# Altium schematic sheet Carrier_MCU.SchDoc: PSoC6
size A; Revision: A; SheetNumber: 8; SheetTotal: 10; ECE315_Project_Name: ECE453 F25 Staff Dev Board
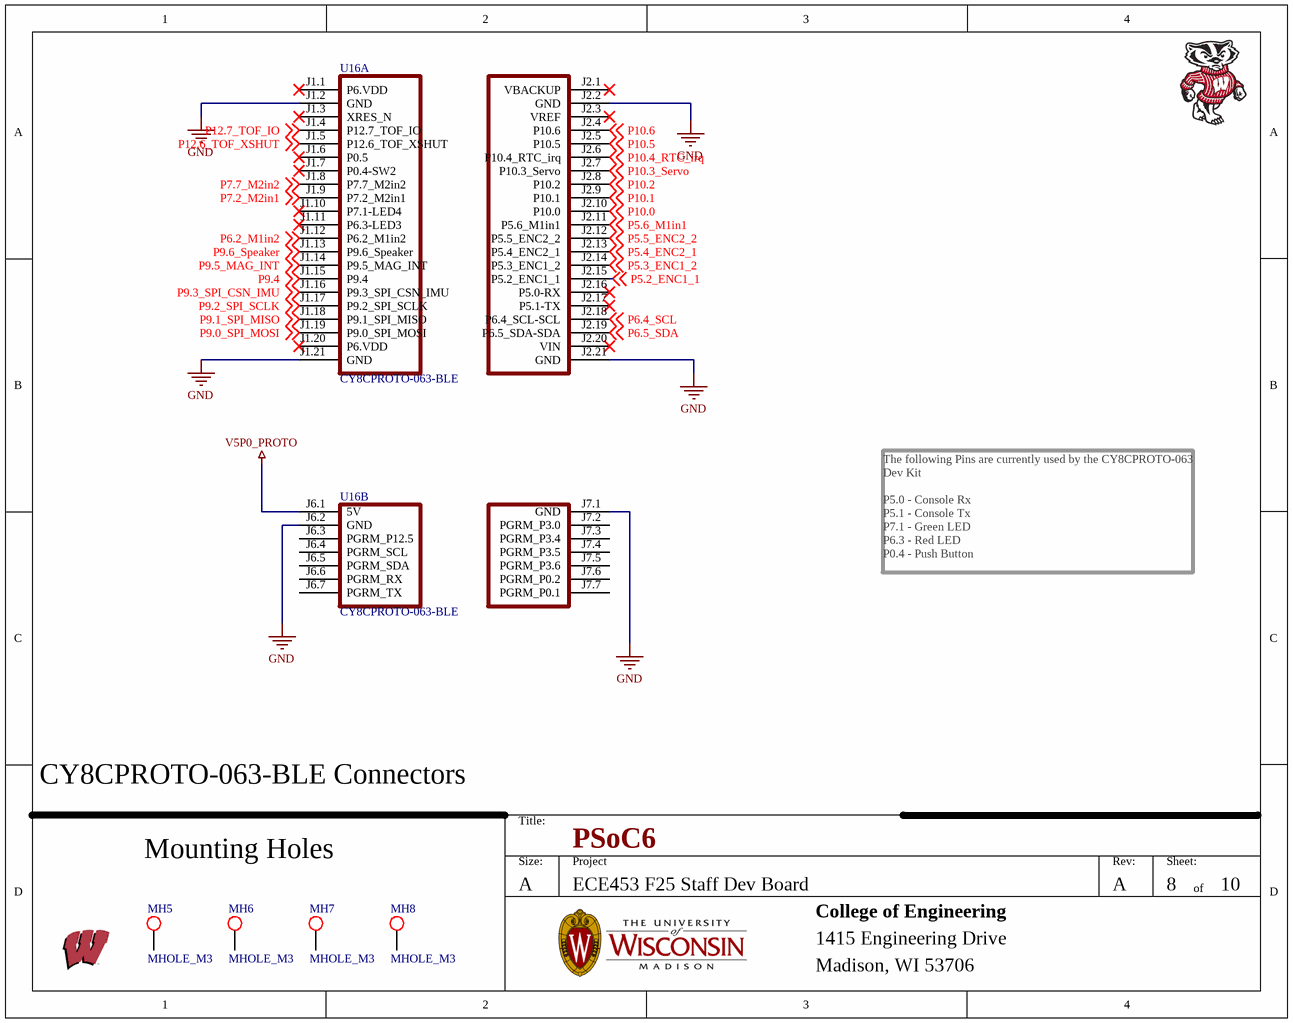
[diagram p0: Carrier_MCU.SchDoc]

## Parts
MH5  MHOLE_M3  [MHOLE_M3]  (no BOM)
MH6  MHOLE_M3  [MHOLE_M3]  (no BOM)
MH7  MHOLE_M3  [MHOLE_M3]  (no BOM)
MH8  MHOLE_M3  [MHOLE_M3]  (no BOM)
U16  CY8CPROTO-063-BLE  [CY8CPROTO-063-BLE]  (parts A,B of 2)  (no BOM)

## Nets
GND: U16.J1.2(GND) U16.J1.21(GND) U16.J2.2(GND) U16.J2.21(GND) U16.J6.2(GND) U16.J7.1(GND)
V5P0_PROTO: U16.J6.1(5V)
P5.2_ENC1_1: U16.J2.15(P5.2_ENC1_1) ; off-sheet P5.2_ENC1_1
P5.3_ENC1_2: U16.J2.14(P5.3_ENC1_2) ; off-sheet P5.3_ENC1_2
P5.4_ENC2_1: U16.J2.13(P5.4_ENC2_1) ; off-sheet P5.4_ENC2_1
P5.5_ENC2_2: U16.J2.12(P5.5_ENC2_2) ; off-sheet P5.5_ENC2_2
P5.6_M1in1: U16.J2.11(P5.6_M1in1) ; off-sheet P5.6_M1in1
P6.2_M1in2: U16.J1.12(P6.2_M1in2) ; off-sheet P6.2_M1in2
P6.4_SCL: U16.J2.18(P6.4_SCL-SCL) ; off-sheet P6.4_SCL
P6.5_SDA: U16.J2.19(P6.5_SDA-SDA) ; off-sheet P6.5_SDA
P7.2_M2in1: U16.J1.9(P7.2_M2in1) ; off-sheet P7.2_M2in1
P7.7_M2in2: U16.J1.8(P7.7_M2in2) ; off-sheet P7.7_M2in2
P9.0_SPI_MOSI: U16.J1.19(P9.0_SPI_MOSI) ; off-sheet P9.0_SPI_MOSI
P9.1_SPI_MISO: U16.J1.18(P9.1_SPI_MISO) ; off-sheet P9.1_SPI_MISO
P9.2_SPI_SCLK: U16.J1.17(P9.2_SPI_SCLK) ; off-sheet P9.2_SPI_SCLK
P9.3_SPI_CSN_IMU: U16.J1.16(P9.3_SPI_CSN_IMU) ; off-sheet P9.3_SPI_CSN_IMU
P9.4: U16.J1.15(P9.4) ; off-sheet P9.4
P9.5_MAG_INT: U16.J1.14(P9.5_MAG_INT) ; off-sheet P9.5_MAG_INT
P9.6_Speaker: U16.J1.13(P9.6_Speaker) ; off-sheet P9.6_Speaker
P10.0: U16.J2.10(P10.0) ; off-sheet P10.0
P10.1: U16.J2.9(P10.1) ; off-sheet P10.1
P10.2: U16.J2.8(P10.2) ; off-sheet P10.2
P10.3_Servo: U16.J2.7(P10.3_Servo) ; off-sheet P10.3_Servo
P10.4_RTC_irq: U16.J2.6(P10.4_RTC_irq) ; off-sheet P10.4_RTC_irq
P10.5: U16.J2.5(P10.5) ; off-sheet P10.5
P10.6: U16.J2.4(P10.6) ; off-sheet P10.6
P12.6_TOF_XSHUT: U16.J1.5(P12.6_TOF_XSHUT) ; off-sheet P12.6_TOF_XSHUT
P12.7_TOF_IO: U16.J1.4(P12.7_TOF_IO) ; off-sheet P12.7_TOF_IO

Not connected (* = marked no-connect by the designer): MH5 1; MH6 1; MH7 1; MH8 1; U16 J1.1(P6.VDD)* J1.3(XRES_N)* J1.6(P0.5)* J1.7(P0.4-SW2)* J1.10(P7.1-LED4)* J1.11(P6.3-LED3)* J1.20(P6.VDD)* J2.1(VBACKUP)* J2.3(VREF)* J2.16(P5.0-RX)* J2.17(P5.1-TX)* J2.20(VIN)* J6.3(PGRM_P12.5) J6.4(PGRM_SCL) J6.5(PGRM_SDA) J6.6(PGRM_RX) J6.7(PGRM_TX) J7.2(PGRM_P3.0) J7.3(PGRM_P3.4) J7.4(PGRM_P3.5) J7.5(PGRM_P3.6) J7.6(PGRM_P0.2) J7.7(PGRM_P0.1)

## Notes on the sheet
- The following Pins are currently used by the CY8CPROTO-063 Dev Kit
  P5.0 - Console Rx
  P5.1 - Console Tx
  P7.1 - Green LED
  P6.3 - Red LED
  P0.4 - Push Button
- CY8CPROTO-063-BLE Connectors
- Mounting Holes
- Title:
- Size:
- A
- Project
- Rev:
- Sheet:
- of
- College of Engineering
- 1415 Engineering Drive
- Madison, WI 53706

## Library data of the parts
MH5-MH8 = MHOLE_M3: Mounting Hole - M3 Metric
U16 = IC_CY8CPROTO-063-BLE